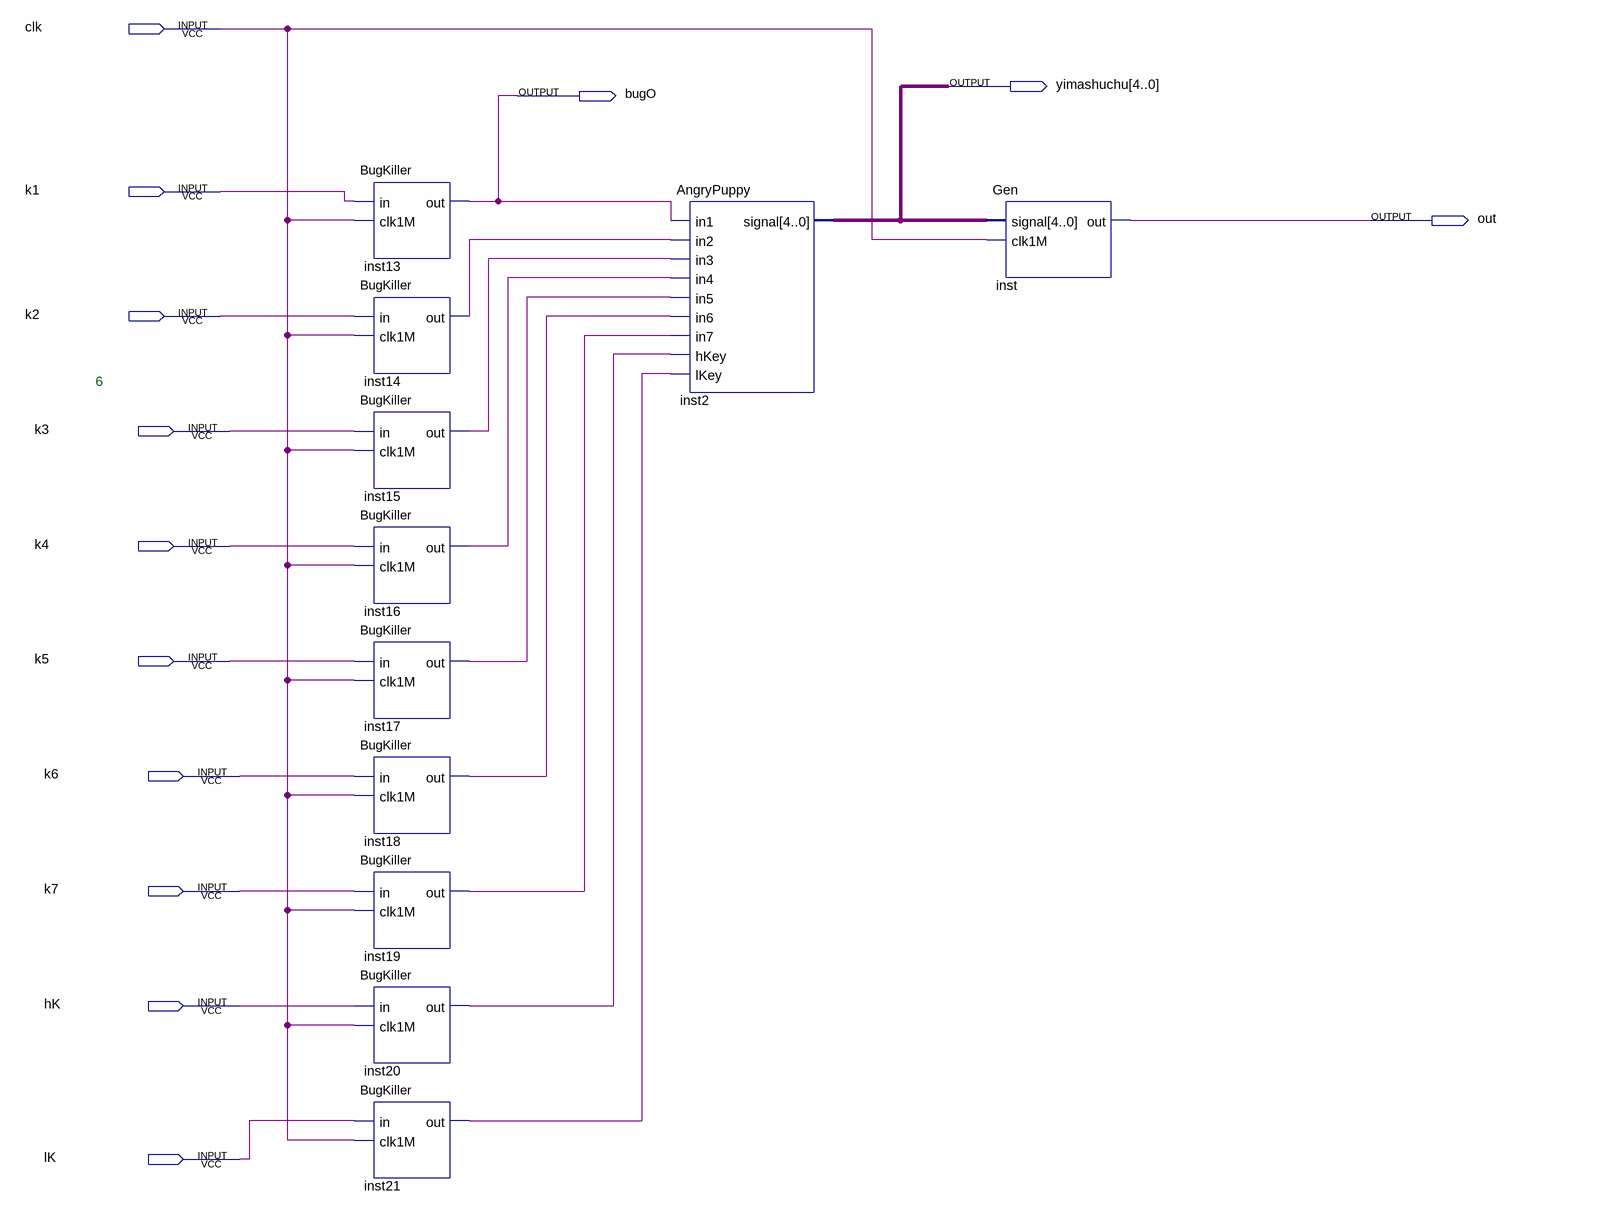
[diagram p0: schematic sheet]
// Quartus schematic ChrisLinn.bdf as structural Verilog: 11 symbols, 13 pins
module ChrisLinn (
  input  clk,
  input  k1,
  input  k2,
  input  k3,
  input  k4,
  input  k5,
  input  k6,
  input  k7,
  input  hK,
  input  lK,
  output [4:0] yimashuchu,
  output bugO,
  output out
);

  wire inst14_out, inst15_out, inst16_out, inst17_out, inst18_out, inst19_out, inst20_out, inst21_out;

  BugKiller inst13 (.in(k1), .clk1M(clk), .out(bugO));
  BugKiller inst14 (.in(k2), .clk1M(clk), .out(inst14_out));
  BugKiller inst15 (.in(k3), .clk1M(clk), .out(inst15_out));
  BugKiller inst16 (.in(k4), .clk1M(clk), .out(inst16_out));
  BugKiller inst17 (.in(k5), .clk1M(clk), .out(inst17_out));
  BugKiller inst18 (.in(k6), .clk1M(clk), .out(inst18_out));
  BugKiller inst19 (.in(k7), .clk1M(clk), .out(inst19_out));
  BugKiller inst20 (.in(hK), .clk1M(clk), .out(inst20_out));
  BugKiller inst21 (.in(lK), .clk1M(clk), .out(inst21_out));
  AngryPuppy inst2 (
    .in1(bugO), .in2(inst14_out), .in3(inst15_out), .in4(inst16_out), .in5(inst17_out), .in6(inst18_out),
    .in7(inst19_out), .hKey(inst20_out), .lKey(inst21_out), .signal(yimashuchu));
  Gen inst (.signal(yimashuchu), .clk1M(clk), .out(out));

  // Notes on the sheet:
  //   6
endmodule
